# EAGLE design V3 nrf5 (EAGLE 9.6.2)
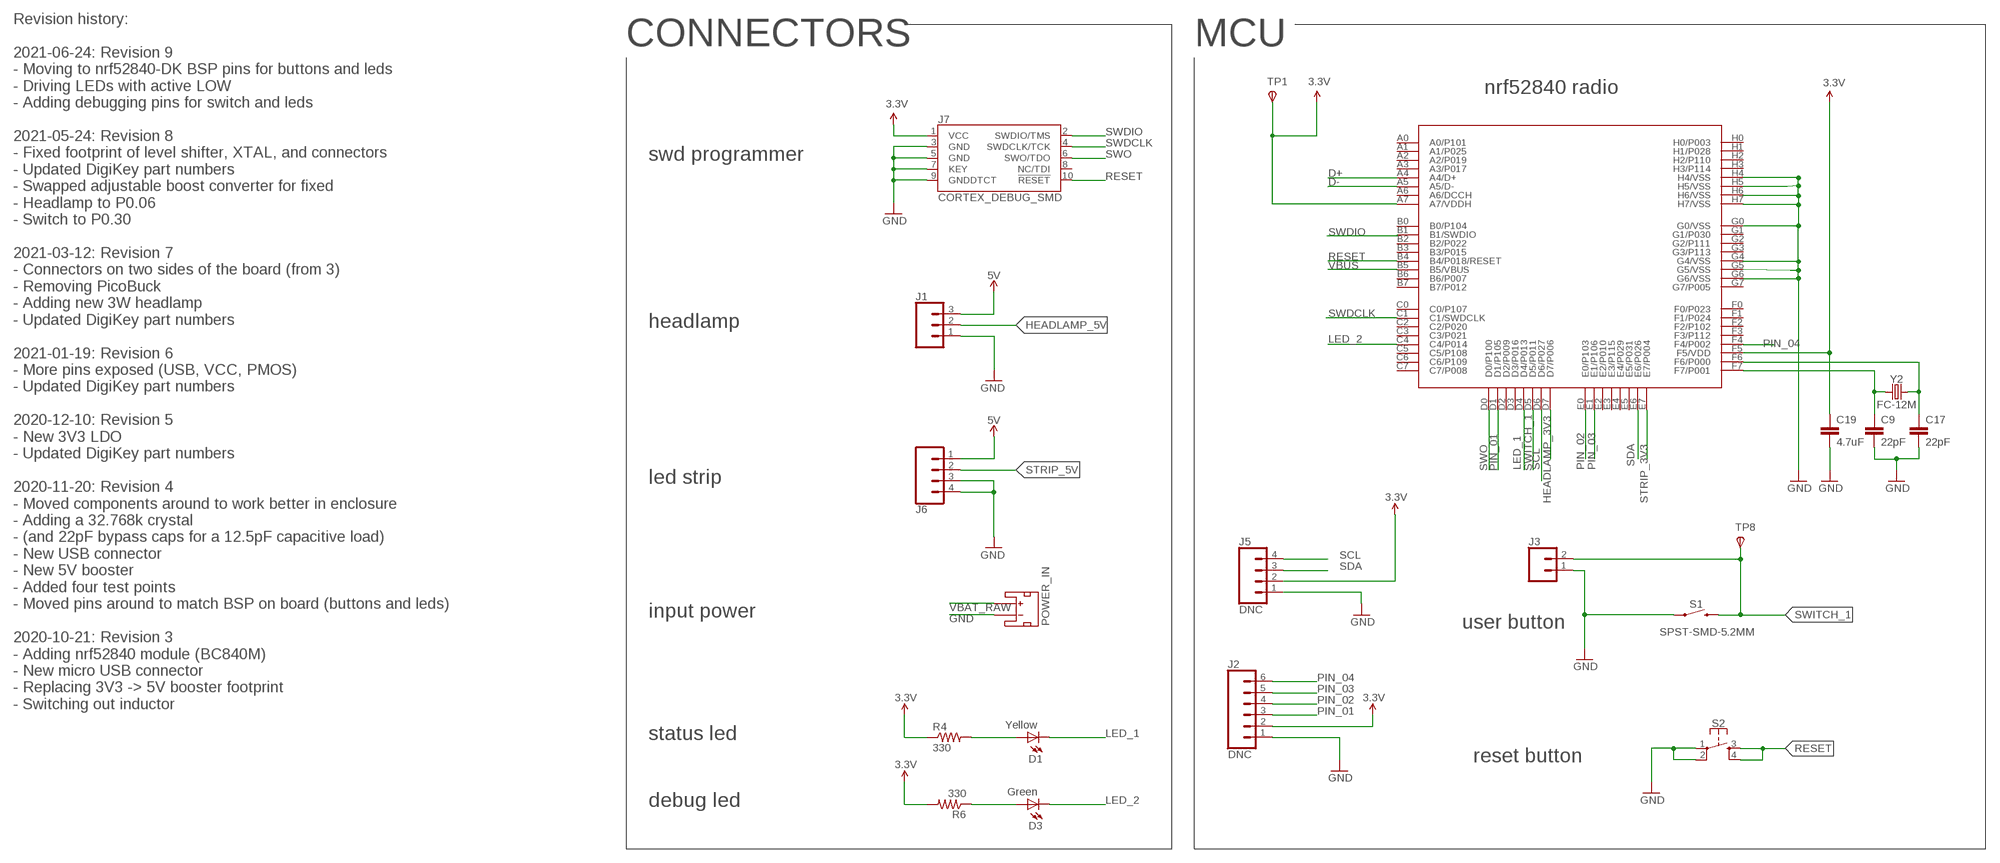
[diagram p0: schematic, sheet 1, part 1 of 2]
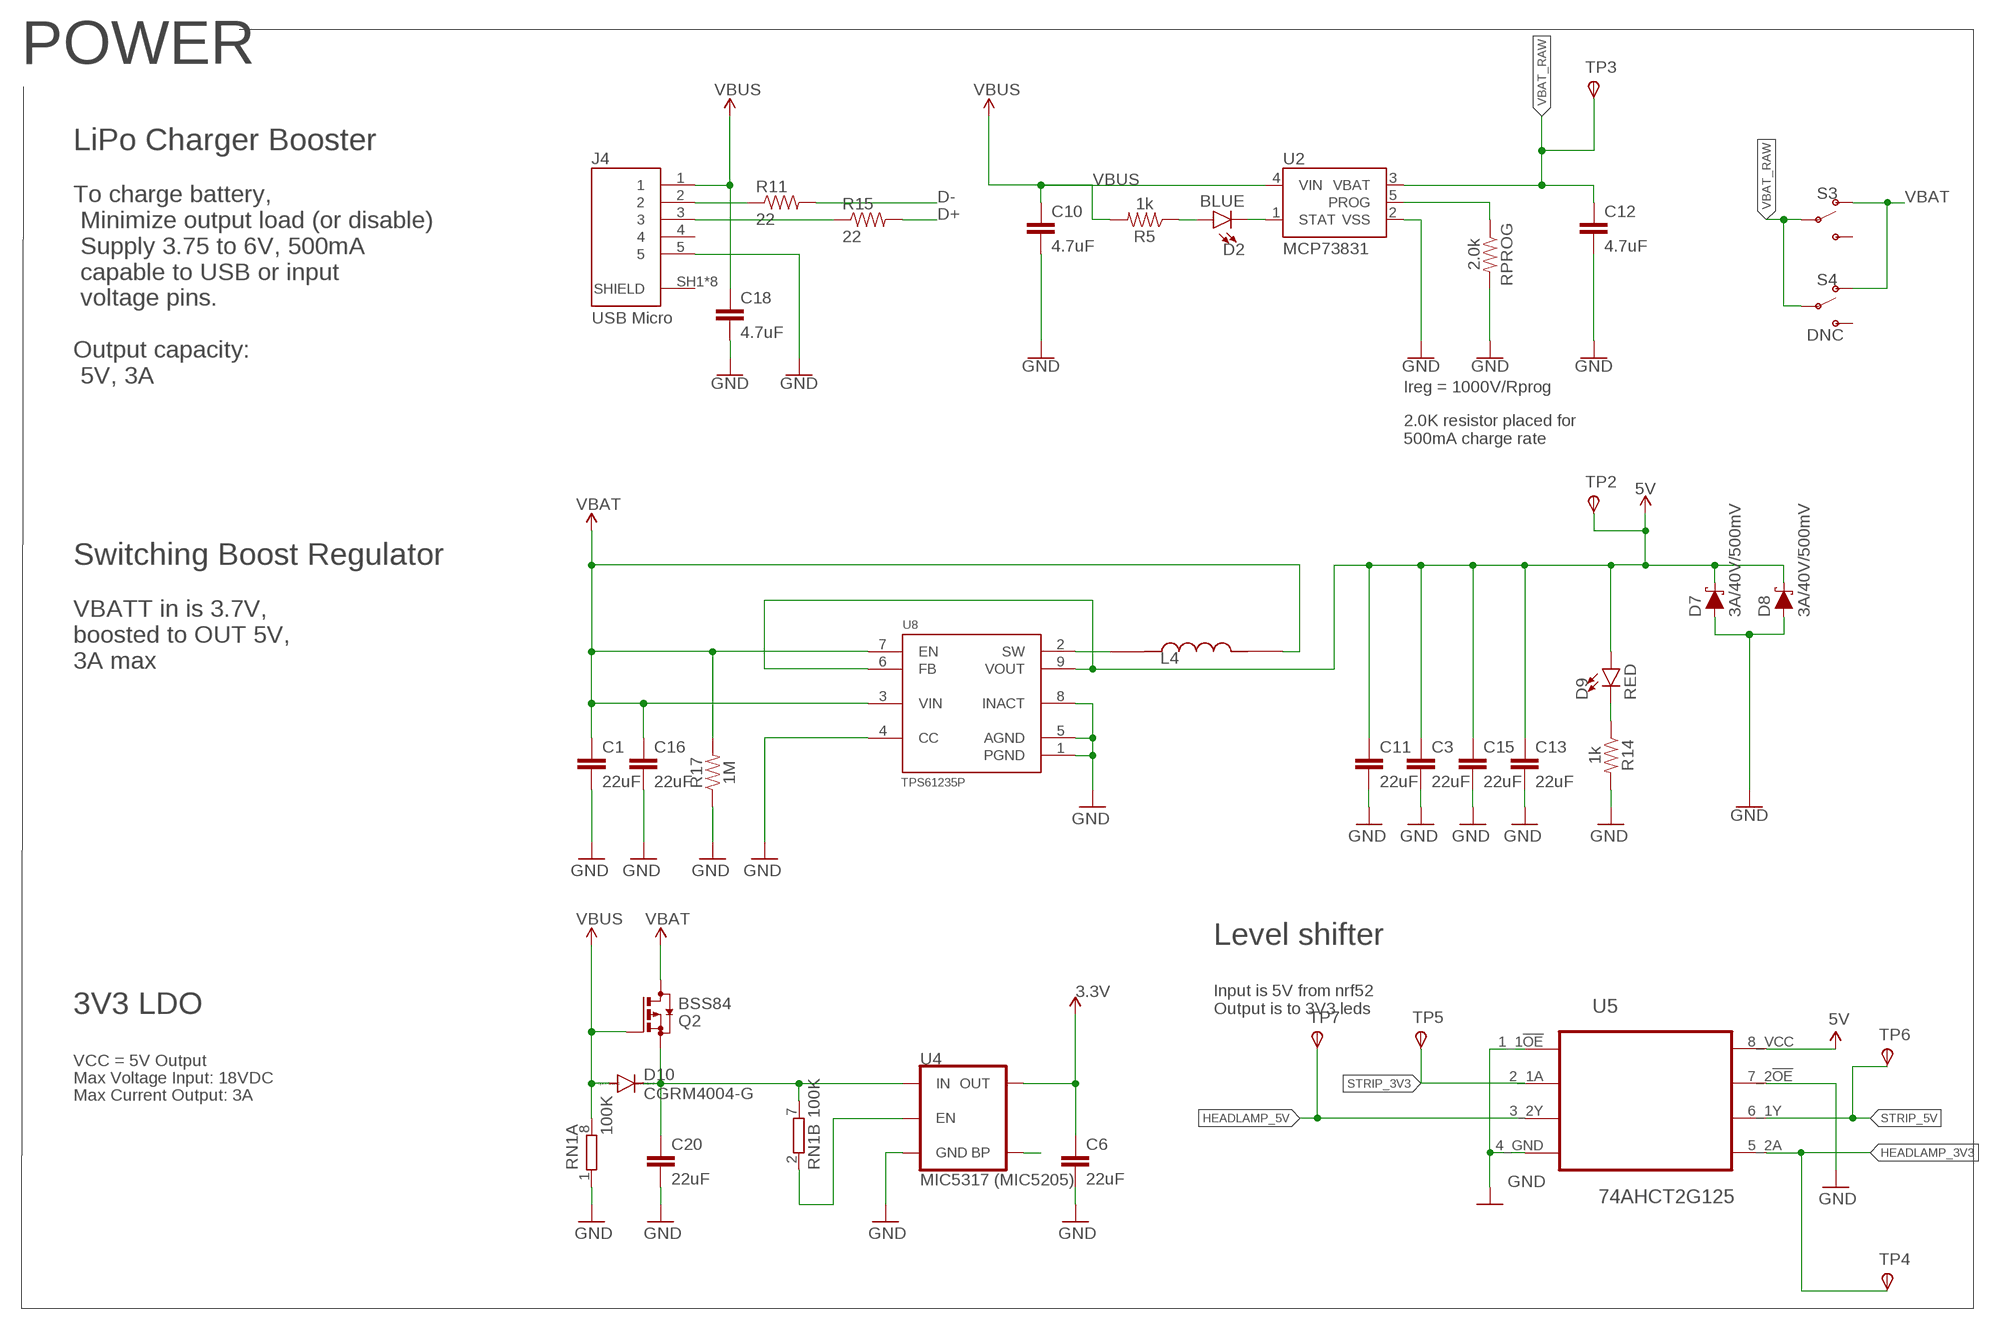
[diagram p1: schematic, sheet 1, part 2 of 2]

## Parts
C1  22uF  22UF-0805-6.3V-20%  [0805]
C3  22uF  22UF-0805-6.3V-20%  [0805]
C6  22uF  22UF-0805-6.3V-20%  [0805]
C9  22pF  22UF-0805-6.3V-20%  [0805]
C10  4.7uF  4.7UF0603  [0603]
C11  22uF  22UF-0805-6.3V-20%  [0805]
C12  4.7uF  4.7UF0603  [0603]
C13  22uF  22UF-0805-6.3V-20%  [0805]
C15  22uF  22UF-0805-6.3V-20%  [0805]
C16  22uF  22UF-0805-6.3V-20%  [0805]
C17  22pF  22UF-0805-6.3V-20%  [0805]
C18  4.7uF  4.7UF0603  [0603]
C19  4.7uF  4.7UF0603  [0603]
C20  22uF  22UF-0805-6.3V-20%  [0805]
D1  Yellow  LED0603  [LED-0603]
D2  BLUE  LED-BLUE0603  [LED-0603]
D3  Green  LED0603  [LED-0603]
D7  3A/40V/500mV  DIODE-SCHOTTKY-B340A  [SMA-DIODE]
D8  3A/40V/500mV  DIODE-SCHOTTKY-B340A  [SMA-DIODE]
D9  RED  LED-RED0603  [LED-0603]
D10  CGRM4004-G  [SOD-123_MINI-SMA]
J1  CONN_03SCREW_LOCK  [SCREWTERMINAL-3.5MM-3_LOCK.007S]
J2  DNC  CONN_06SMD-1MM  [1X06-1MM]
J3  CONN_02  [1X02]
J4  USB Micro  1050170001  [MOLEX_1050170001]
J5  DNC  CONN_04SMD2  [1X04_1MM_RA]
J6  CONN_04SCREW  [SCREWTERMINAL-3.5MM-4]
J7  CORTEX_DEBUG_SMD  [SAMTECH_FTSH-105-01]
L4  1.0 uH  FDSD0630-H-1R0M=P3  [IND_FDSD0630-H-1R0M=P3]
POWER_IN  JST_2MM_MALE  [JST-2-SMD]
Q2  BSS84  [SOT23]
R4  330  RESISTOR0603-RES  [0603-RES]
R5  1k  1KOHM-0603-1/10W-1%  [0603]
R6  330  RESISTOR0603-RES  [0603-RES]
R11  22  RESISTOR0603-RES  [0603-RES]
R14  1k  1KOHM-0603-1/10W-1%  [0603]
R15  22  RESISTOR0603-RES  [0603-RES]
R17  1M  750KOHM-0603-1/10W-1%  [0603@1]
RN1  100K  4R-NEXB38V  [EXB38V]
RPROG  2.0k  2.0KOHM-0603-1/10W-5%  [0603]
S1  SPST-SMD-5.2MM  MOMENTARY-SWITCH-SPST-SMD-5.2MM  [TACTILE_SWITCH_SMD_5.2MM]
S2  MOMENTARY-SWITCH-SPST-2-SMD-4.6X2.8MM  [TACTILE_SWITCH_SMD_4.6X2.8MM]
S3  SWITCH-SPDT-SMD-RIGHT-ANGLE  [SWITCH_SPST_SMD_A]
S4  DNC  SWITCH-SPDT-PTH-11.6X4.0MM  [SWITCH_SPDT_PTH_11.6X4.0MM]
TP1  TPSB1,27  [B1,27]
TP2  TPSB1,27  [B1,27]
TP3  TPSB1,27  [B1,27]
TP4  TPSB1,27  [B1,27]
TP5  TPSB1,27  [B1,27]
TP6  TPSB1,27  [B1,27]
TP7  TPSB1,27  [B1,27]
TP8  TPSB1,27  [B1,27]
U2  MCP73831  [SOT23-5]
U3  BC840M  [BC840M]
U4  MIC5317 (MIC5205)  V_REG_MIC52053.3V  [SOT23-5]
U5  74AHCT2G125  VSSOP-8_DEVICE  [VSSOP-8]
U8  TPS61235P  TPS61235PRWLR  [CONV_TPS61235PRWLR]
Y2  FC-12M  [FC-12M]

## Nets
3.3V: C6.1 C19.1 J2.2 J5.2 J7.1(VCC) R4.1 R6.2 TP1.TP(PP) U3.A7(A7/VDDH) U3.F5(F5/VDD) U4.5(OUT) ; supply symbol labelled VCC
5V: C3.1 C11.1 C13.1 C15.1 D7.C D8.C D9.A J1.3 J6.1 TP2.TP(PP) U5.8_VCC U8.6(FB) U8.9(VOUT)
D+: R15.2 U3.A4(A4/D+)
D-: R11.2 U3.A5(A5/D-)
GND: C1.2 C3.2 C6.2 C9.2 C10.2 C11.2 C12.2 C13.2 C15.2 C16.2 C17.2 C18.2 C19.2 C20.2 D7.A D8.A J1.1 J2.1 J3.1 J4.5 J5.1 J6.3 J6.4 J7.3(GND) J7.5(GND) J7.7(KEY) J7.9(GNDDTCT) POWER_IN.1(-) R14.2 R17.1 RN1.1 RPROG.2 S1.1 S2.1 S2.2 U2.2(VSS) U3.G0(G0/VSS) U3.G4(G4/VSS) U3.G5(G5/VSS) U3.G6(G6/VSS) U3.H4(H4/VSS) U3.H5(H5/VSS) U3.H6(H6/VSS) U3.H7(H7/VSS) U4.2(GND) U5.1_1!OE U5.4_GND U5.7_2!OE U8.1(PGND) U8.4(CC) U8.5(AGND) U8.8(INACT)
HEADLAMP_3V3: TP4.TP(PP) U3.D7(D7/P006) U5.5_2A
HEADLAMP_5V: J1.2 TP7.TP(PP) U5.3_2Y
LED_1: D1.C U3.D4(D4/P013)
LED_2: D3.C U3.C4(C4/P014)
N$1: D1.A R4.2
N$2: C9.1 U3.F7(F7/P001) Y2.1
N$3: L4.1 U8.2(SW)
N$4: C20.1 D10.C Q2.2(S) RN1.7 U4.1(IN)
N$5: RN1.2 U4.3(EN)
N$6: U4.4(BP)
N$8: D3.A R6.1
N$11: RPROG.1 U2.5(PROG)
N$12: J4.2 R11.1
N$13: D9.C R14.1
N$14: D2.C U2.1(STAT)
N$15: D2.A R5.1
N$16: J4.3 R15.1
N$17: C17.1 U3.F6(F6/P000) Y2.2
PIN_01: J2.3 U3.D1(D1/P105)
PIN_02: J2.4 U3.E0(E0/P103)
PIN_03: J2.5 U3.E1(E1/P106)
PIN_04: J2.6 U3.F4(F4/P002)
RESET: J7.10(!RESET) S2.3 S2.4 U3.B4(B4/P018/RESET)
SCL: J5.4 U3.D6(D6/P027)
SDA: J5.3 U3.E6(E6/P026)
STRIP_3V3: TP5.TP(PP) U3.E7(E7/P004) U5.2_1A
STRIP_5V: J6.2 TP6.TP(PP) U5.6_1Y
SWDCLK: J7.4(SWDCLK/TCK) U3.C1(C1/SWDCLK)
SWDIO: J7.2(SWDIO/TMS) U3.B1(B1/SWDIO)
SWITCH_1: J3.2 S1.3 TP8.TP(PP) U3.D5(D5/P011)
SWO: J7.6(SWO/TDO) U3.D0(D0/P100)
VBAT: C1.1 C16.1 L4.2 Q2.3(D) R17.2 S3.1(O) S4.1(O) U8.3(VIN) U8.7(EN)
VBAT_RAW: C12.1 POWER_IN.2(+) S3.2(P) S4.2(P) TP3.TP(PP) U2.3(VBAT)
VBUS: C10.1 C18.1 D10.A J4.1 Q2.1(G) R5.2 RN1.8 U2.4(VIN) U3.B5(B5/VBUS)
Unconnected: J4.4 J4.SH1(SHIELD) J4.SH2(SHIELD) J4.SH3(SHIELD) J4.SH4(SHIELD) J4.SH5(SHIELD) J4.SH6(SHIELD) J4.SH7(SHIELD) J4.SH8(SHIELD) J7.8(NC/TDI) POWER_IN.NC1(PAD1) POWER_IN.NC2(PAD2) RN1.3 RN1.4 RN1.5 RN1.6 S3.3(S) S4.3(S) U3.A0(A0/P101) U3.A1(A1/P025) U3.A2(A2/P019) U3.A3(A3/P017) U3.A6(A6/DCCH) U3.B0(B0/P104) U3.B2(B2/P022) U3.B3(B3/P015) U3.B6(B6/P007) U3.B7(B7/P012) U3.C0(C0/P107) U3.C2(C2/P020) U3.C3(C3/P021) U3.C5(C5/P108) U3.C6(C6/P109) U3.C7(C7/P008) U3.D2(D2/P009) U3.D3(D3/P016) U3.E2(E2/P010) U3.E3(E3/P115) U3.E4(E4/P029) U3.E5(E5/P031) U3.F0(F0/P023) U3.F1(F1/P024) U3.F2(F2/P102) U3.F3(F3/P112) U3.G1(G1/P030) U3.G2(G2/P111) U3.G3(G3/P113) U3.G7(G7/P005) U3.H0(H0/P003) U3.H1(H1/P028) U3.H2(H2/P110) U3.H3(H3/P114)

## Notes on the sheet
- Revision history:
  
  2021-06-24: Revision 9
  - Moving to nrf52840-DK BSP pins for buttons and leds
  - Driving LEDs with active LOW
  - Adding debugging pins for switch and leds
  
  2021-05-24: Revision 8
  - Fixed footprint of level shifter, XTAL, and connectors
  - Updated DigiKey part numbers
  - Swapped adjustable boost converter for fixed
  - Headlamp to P0.06
  - Switch to P0.30
  
  2021-03-12: Revision 7
  - Connectors on two sides of the board (from 3)
  - Removing PicoBuck
  - Adding new 3W headlamp
  - Updated DigiKey part numbers
  
  2021-01-19: Revision 6
  - More pins exposed (USB, VCC, PMOS)
  - Updated DigiKey part numbers
  
  2020-12-10: Revision 5
  - New 3V3 LDO
  - Updated DigiKey part numbers
  
  2020-11-20: Revision 4
  - Moved components around to work better in enclosure
  - Adding a 32.768k crystal 
  - (and 22pF bypass caps for a 12.5pF capacitive load) 
  - New USB connector
  - New 5V booster
  - Added four test points
  - Moved pins around to match BSP on board (buttons and leds)
  
  2020-10-21: Revision 3
  - Adding nrf52840 module (BC840M)
  - New micro USB connector
  - Replacing 3V3 -> 5V booster footprint
  - Switching out inductor
- CONNECTORS | MCU | POWER
- nrf52840 radio
- LiPo Charger Booster
- To charge battery,
   Minimize output load (or disable)
   Supply 3.75 to 6V, 500mA
   capable to USB or input
   voltage pins.
- swd programmer
- Output capacity:
   5V, 3A
- Ireg = 1000V/Rprog
- 2.0K resistor placed for
  500mA charge rate
- headlamp
- Switching Boost Regulator
- VBATT in is 3.7V, 
  boosted to OUT 5V, 
  3A max
- led strip
- input power
- user button | Level shifter
- 3V3 LDO
- Input is 5V from nrf52
  Output is to 3V3 leds
- VCC = 5V Output
- Max Voltage Input: 18VDC
- Max Current Output: 3A
- status led
- reset button
- debug led

## Library data of the parts
C1 C3 C6 C11 C13 C15 C16 C20 = SparkFun-Capacitors:22UF: 22µF ceramic capacitors A capacitor is a passive two-terminal electrical component used to store electrical energy temporarily in an electric field.; DIGIKEY: 490-10511-1-ND; PROD_ID: CAP-08402
C9 C17 = SparkFun-Capacitors:22UF: 22µF ceramic capacitors A capacitor is a passive two-terminal electrical component used to store electrical energy temporarily in an electric field.; DIGIKEY: 399-C0805C220K5HAC7800CT-ND; PROD_ID: CAP-08402; VALUE: 22uF
C10 C12 C18 C19 = SparkFun-Capacitors:4.7UF: 4.7µF ceramic capacitors A capacitor is a passive two-terminal electrical component used to store electrical energy temporarily in an electric field.; DIGIKEY: 399-3482-1-ND; PROD_ID: CAP-08280
D1 = SparkFun:LED: LEDs Standard schematic elements and footprints for 5mm, 3mm, 1206, and 0603 sized LEDs. 5mm - Spark Fun Electronics SKU : COM-00529 (and others); DIGIKEY: 160-1184-1-ND
D2 = SparkFun-LED:LED-BLUE: Blue SMD LED Used in manufacturing of various products at SparkFun Packages: 0603 - SMD 0603 package [Product Link] <http://www.digikey.com/product-detail/en/SMLE12BC7TT86/511-1589-2-ND/1641808> 1206 - SMD1206 package [Product Link] <http://www.digikey.com/product-detail/en/lite-on-inc/LTST-C150TBKT/160-1643-1-ND/573584> SparkFun Products: ESP8266 Thing-Dev Board <https://www.sparkfun.com/products/13711> RedBoard <https://www.sparkfun.com/products/12757>; DIGIKEY: 160-1647-1-ND; PROD_ID: DIO-08575
D3 = SparkFun:LED: LEDs Standard schematic elements and footprints for 5mm, 3mm, 1206, and 0603 sized LEDs. 5mm - Spark Fun Electronics SKU : COM-00529 (and others); DIGIKEY: 754-1116-2-ND
D7 D8 = SparkFun-DiscreteSemi:DIODE-SCHOTTKY: Schottky diode A Schottky diode is a semiconductor diode which has a low forward voltage drop and a very fast switching action.; DIGIKEY: MBRA340T3GOSTR-ND; PROD_ID: DIO-09886
D9 = SparkFun-LED:LED-RED: Red SMD LED Used in manufacturing of most products at SparkFun Packages: 0603 - SMD 0603 package [Product Link] <http://docs.avagotech.com/docs/AV02-0551EN> 0603 SMART - SMD 0603 SMART package ( more efficient and expensive)[Product Link] <http://www.osram-os.com/Graphics/XPic2/00077099_0.pdf> 1206 - SMD1206 package [Product Link] <https://www.sparkfun.com/datasheets/DevTools/LilyPad/Q150OVS4.pdff> SparkFun Products: Pro Mini 328 -5V <https://www.sparkfun.com/products/821> RedBoard <https://www.sparkfun.com/products/12757> IOIO-OTG <https://www.sparkfun.com/products/13613>; DIGIKEY: 160-1436-1-ND; PROD_ID: DIO-00819
D10 = diode:CGRM400*-G: Molded plasitc,JEDEC SOD-123/Mini SMA Source: Comchip CGRM4001-G.pdf; DIGIKEY: SM5817PL-TPMSCT-ND‎
J1 = SparkFun-Connectors:CONN_03: Multi connection point. Often used as Generic Header-pin footprint for 0.1 inch spaced/style header connections On any of the 0.1 inch spaced packages, you can populate with these: Break Away Headers - Straight <https://www.sparkfun.com/products/116> (PRT-00116) Break Away Male Headers - Right Angle <https://www.sparkfun.com/products/553> (PRT-00553) Female Headers <https://www.sparkfun.com/products/115> (PRT-00115) Break Away Headers - Machine Pin <https://www.sparkfun.com/products/117> (PRT-00117) Break Away Female Headers - Swiss Machine Pin <https://www.sparkfun.com/products/743> (PRT-00743) Stackable Header - 3 Pin (Female, 0.1") <https://www.sparkfun.com/products/13875> (PRT-13875) For SCREWTERMINALS and SPRING TERMINALS visit here: Screw Terimnals on SparkFun.com <https://www.sparkfun.com/search/results?term=Screw+Terminals> (5mm/3.5mm/2.54mm spacing) This device is also useful as a general connection point to wire up your design to another part of your project. Our various solder wires solder well into these plated through hole pads. Hook-Up Wire - Assortment (Stranded, 22 AWG) <https://www.sparkfun.com/products/11375> (PRT-11375) Hook-Up Wire - Assortment (Solid Core, 22 AWG) <https://www.sparkfun.com/products/11367> (PRT-11367) View the entire wire category on our website here <https://www.sparkfun.com/categories/141> Special notes: Molex polarized connector foot print use with SKU : PRT-08232 with associated crimp pins and housings.; DIGIKEY: A98037-ND; PROD_ID: CONN-08288; SF_ID: PRT-08235
J2 = SparkFun-Connectors:CONN_06: Multi connection point. Often used as Generic Header-pin footprint for 0.1 inch spaced/style header connections On any of the 0.1 inch spaced packages, you can populate with these: Break Away Headers - Straight <https://www.sparkfun.com/products/116> (PRT-00116) Break Away Male Headers - Right Angle <https://www.sparkfun.com/products/553> (PRT-00553) Female Headers <https://www.sparkfun.com/products/115> (PRT-00115) Break Away Headers - Machine Pin <https://www.sparkfun.com/products/117> (PRT-00117) Break Away Female Headers - Swiss Machine Pin <https://www.sparkfun.com/products/743> (PRT-00743) Arduino Stackable Header - 6 Pin <https://www.sparkfun.com/products/9280> (PRT-09280) For SCREWTERMINALS and SPRING TERMINALS visit here: Screw Terimnals on SparkFun.com <https://www.sparkfun.com/search/results?term=Screw+Terminals> (5mm/3.5mm/2.54mm spacing) This device is also useful as a general connection point to wire up your design to another part of your project. Our various solder wires solder well into these plated through hole pads. Hook-Up Wire - Assortment (Stranded, 22 AWG) <https://www.sparkfun.com/products/11375> (PRT-11375) Hook-Up Wire - Assortment (Solid Core, 22 AWG) <https://www.sparkfun.com/products/11367> (PRT-11367) View the entire wire category on our website here <https://www.sparkfun.com/categories/141>; PROD_ID: CONN-08249; SF_ID: GPS-00579
J3 = SparkFun-Connectors:CONN_02: Multi connection point. Often used as Generic Header-pin footprint for 0.1 inch spaced/style header connections On any of the 0.1 inch spaced packages, you can populate with these: Break Away Headers - Straight <https://www.sparkfun.com/products/116> (PRT-00116) Break Away Male Headers - Right Angle <https://www.sparkfun.com/products/553> (PRT-00553) Female Headers <https://www.sparkfun.com/products/115> (PRT-00115) Break Away Headers - Machine Pin <https://www.sparkfun.com/products/117> (PRT-00117) Break Away Female Headers - Swiss Machine Pin <https://www.sparkfun.com/products/743> (PRT-00743) For SCREWTERMINALS and SPRING TERMINALS visit here: Screw Terimnals on SparkFun.com <https://www.sparkfun.com/search/results?term=Screw+Terminals> (5mm/3.5mm/2.54mm spacing) This device is also useful as a general connection point to wire up your design to another part of your project. Our various solder wires solder well into these plated through hole pads. Hook-Up Wire - Assortment (Stranded, 22 AWG) <https://www.sparkfun.com/products/11375> (PRT-11375) Hook-Up Wire - Assortment (Solid Core, 22 AWG) <https://www.sparkfun.com/products/11367> (PRT-11367) View the entire wire category on our website here <https://www.sparkfun.com/categories/141> Special notes: Molex polarized connector foot print use with: PRT-08233 with associated crimp pins and housings. 2.54_SCREWTERM for use with PRT-10571. 3.5mm Screw Terminal footprints for PRT-08084 5mm Screw Terminal footprints for use with PRT-08432
J4 = 1050170001:1050170001: Conn.; Data; USB; Recept.; Micro; B Type; Bottom Mount, SMT, with Solder Tabs, Lead-Free Check prices <https://pricing.snapeda.com/parts/1050170001/Molex/view-part?ref=eda>; AVAILABILITY: Good; DESCRIPTION: USB - micro B USB 2.0 Receptacle Connector 5 Position Surface Mount, Right Angle; Through Hole; DIGIKEY: WM1399CT-ND; MF: Molex; MP: 1050170001; PACKAGE: None; PRICE: None; PURCHASE-URL: https://pricing.snapeda.com/search/part/1050170001/?ref=eda
J5 = SparkFun-Connectors:CONN_04: Multi connection point. Often used as Generic Header-pin footprint for 0.1 inch spaced/style header connections On any of the 0.1 inch spaced packages, you can populate with these: Break Away Headers - Straight <https://www.sparkfun.com/products/116> (PRT-00116) Break Away Male Headers - Right Angle <https://www.sparkfun.com/products/553> (PRT-00553) Female Headers <https://www.sparkfun.com/products/115> (PRT-00115) Break Away Headers - Machine Pin <https://www.sparkfun.com/products/117> (PRT-00117) Break Away Female Headers - Swiss Machine Pin <https://www.sparkfun.com/products/743> (PRT-00743) For SCREWTERMINALS and SPRING TERMINALS visit here: Screw Terimnals on SparkFun.com <https://www.sparkfun.com/search/results?term=Screw+Terminals> (5mm/3.5mm/2.54mm spacing) This device is also useful as a general connection point to wire up your design to another part of your project. Our various solder wires solder well into these plated through hole pads. Hook-Up Wire - Assortment (Stranded, 22 AWG) <https://www.sparkfun.com/products/11375> (PRT-11375) Hook-Up Wire - Assortment (Solid Core, 22 AWG) <https://www.sparkfun.com/products/11367> (PRT-11367) View the entire wire category on our website here <https://www.sparkfun.com/categories/141> Special notes: Molex polarized connector foot print use with SKU : PRT-08231 with associated crimp pins and housings. 1MM SMD Version SKU: PRT-10208; PROD_ID: CONN-10310; SF_ID: PRT-10208
J6 = SparkFun-Connectors:CONN_04: Multi connection point. Often used as Generic Header-pin footprint for 0.1 inch spaced/style header connections On any of the 0.1 inch spaced packages, you can populate with these: Break Away Headers - Straight <https://www.sparkfun.com/products/116> (PRT-00116) Break Away Male Headers - Right Angle <https://www.sparkfun.com/products/553> (PRT-00553) Female Headers <https://www.sparkfun.com/products/115> (PRT-00115) Break Away Headers - Machine Pin <https://www.sparkfun.com/products/117> (PRT-00117) Break Away Female Headers - Swiss Machine Pin <https://www.sparkfun.com/products/743> (PRT-00743) For SCREWTERMINALS and SPRING TERMINALS visit here: Screw Terimnals on SparkFun.com <https://www.sparkfun.com/search/results?term=Screw+Terminals> (5mm/3.5mm/2.54mm spacing) This device is also useful as a general connection point to wire up your design to another part of your project. Our various solder wires solder well into these plated through hole pads. Hook-Up Wire - Assortment (Stranded, 22 AWG) <https://www.sparkfun.com/products/11375> (PRT-11375) Hook-Up Wire - Assortment (Solid Core, 22 AWG) <https://www.sparkfun.com/products/11367> (PRT-11367) View the entire wire category on our website here <https://www.sparkfun.com/categories/141> Special notes: Molex polarized connector foot print use with SKU : PRT-08231 with associated crimp pins and housings. 1MM SMD Version SKU: PRT-10208; DIGIKEY: 277-1860-ND; PROD_ID: 2xCONN-08399; SF_ID: 2xPRT-08084
J7 = SparkFun-Connectors:CORTEX_DEBUG: Cortex Debug Connector - 10 pin Supports JTAG debug, Serial Wire debug, and Serial Wire Viewer. PTH and SMD connector options available. General Connector Information <http://infocenter.arm.com/help/topic/com.arm.doc.faqs/attached/13634/cortex_debug_connectors.pdf> Products: PTH Connector <http://www.digikey.com/product-detail/en/cnc-tech/3220-10-0100-00/1175-1627-ND/3883661> -via Digi-Key SparkFun PSoc <https://www.sparkfun.com/products/13229> SparkFun T <https://www.sparkfun.com/products/13810>; DIGIKEY: SAM1161-05-ND
L4 = FDSD0630-H-1R0M_P3:FDSD0630-H-1R0M=P3: 2.2µH Shielded Wirewound Inductor 7.1A 17mOhm Max Nonstandard; DESCRIPTION: Inductor with Inductance: 1uH Tol. +/-20%, Package: 2726 (7066); DIGI-KEY_PART_NUMBER: 490-10878-1-ND; DIGIKEY: 490-10878-1-ND; MF: Murata; MP: FDSD0630-H-1R0M=P3; PACKAGE: NONSTANDARD; PURCHASE-URL: https://pricing.snapeda.com/search/part/FDSD0630-H-1R0M=P3/?ref=eda
POWER_IN = SparkFun-Connectors:JST_2MM_MALE: JST 2MM MALE RA CONNECTOR Two pin, compact surface mount connector. Commonly used as a battery input connection point. We really like the solid locking feeling and high current rating on these small connectors. We use these all the time as battery connectors. Mates to single-cell LiPo batteries. Here is the connector we sell at SparkFun: JST Right Angle Connector - White <https://www.sparkfun.com/products/8612> (PRT-08612) Datasheet <http://www.sparkfun.com/datasheets/Prototyping/Connectors/JST-Horizontal.pdf> It was used on these SparkFun products: SparkFun MOSFET Power Controller <https://www.sparkfun.com/products/11214> (PRT-11214) SparkFun Battery Babysitter - LiPo Battery Manager <https://www.sparkfun.com/products/13777> (PRT-13777) And many, many others that required a lipo battery connection.; DIGIKEY: A100080CT-ND; PROD_ID: CONN-11443; SF_ID: PRT-08612
Q2 = transistor-small-signal:BSS84: P-CHANNEL MOS FET; DIGIKEY: DMP2120U-7DITR-ND
R4 R6 = SparkFun:RESISTOR: Resistor Basic schematic elements and footprints for 0603, 1206, and PTH resistors.; DIGIKEY: 311-330HRTR-ND
R5 R14 = SparkFun-Resistors:1KOHM: 1kΩ resistor A resistor is a passive two-terminal electrical component that implements electrical resistance as a circuit element. Resistors act to reduce current flow, and, at the same time, act to lower voltage levels within circuits. - Wikipedia; DIGIKEY: RMCF0603FG1K00; PROD_ID: RES-07856
R11 R15 = SparkFun:RESISTOR: Resistor Basic schematic elements and footprints for 0603, 1206, and PTH resistors.; DIGIKEY: A103067TR-ND
R17 = SparkFun-Resistors:750KOHM: 750Ω resistor A resistor is a passive two-terminal electrical component that implements electrical resistance as a circuit element. Resistors act to reduce current flow, and, at the same time, act to lower voltage levels within circuits. - Wikipedia; DIGIKEY: RMCF0603FT1M00; PROD_ID: RES-13768; VALUE: 750K
RN1 = resistor-dil:4R-N: Array Chip Resistor Source: RS Component / Phycomp; DIGIKEY: YC164J-100KTR-ND; OC_FARNELL: unknown; OC_NEWARK: unknown
RPROG = SparkFun-Resistors:2.0KOHM: 2kΩ resistor A resistor is a passive two-terminal electrical component that implements electrical resistance as a circuit element. Resistors act to reduce current flow, and, at the same time, act to lower voltage levels within circuits. - Wikipedia; DIGIKEY: ‎311-2.00KHRCT-ND‎; PROD_ID: RES-08296
S1 = SparkFun-Switches:MOMENTARY-SWITCH-SPST: Momentary Switch (Pushbutton) - SPST Normally-open (NO) SPST momentary switches (buttons, pushbuttons). Variants PTH-12MM - 12mm square, through-hole Momentary Pushbutton Switch - 12mm Square <https://www.sparkfun.com/products/9190> (COM-09190) PTH-6.0MM, PTH-6.0MM-KIT - 6.0mm square, through-hole Mini Pushbutton Switch <https://www.sparkfun.com/products/97> (COM-00097) KIT package intended for soldering kit's - only one side of pads' copper is exposed. PTH-RIGHT-ANGLE-KIT - Right-angle, through-hole Right Angle Tactile Button <https://www.sparkfun.com/products/10791> - Used on SparkFun BigTime Watch Kit <https://www.sparkfun.com/products/11734> SMD-12MM - 12mm square, surface-mount Tactile Button - SMD (12mm) <https://www.sparkfun.com/products/12993> (COM-12993) Used on SparkFun PicoBoard <https://www.sparkfun.com/products/11888> SMD-4.5MM - 4.5mm Square Trackball Switch Used on SparkFun Blackberry Trackballer Breakout <https://www.sparkfun.com/products/13169> SMD-4.6MMX2.8MM - 4.60mm x 2.80mm, surface mount Used on SparkFun SAMD21 Mini Breakout <https://www.sparkfun.com/products/13664> SMD-5.2MM, SMD-5.2-REDUNDANT - 5.2mm square, surface-mount Mini Pushbutton Switch - SMD <https://www.sparkfun.com/products/8720> (COM-08720) Used on Arduino Pro Mini <https://www.sparkfun.com/products/11114> REDUNDANT package connects both switch circuits together SMD-6.0X3.5MM - 6.0 x 3.5mm, surface mount Momentary Reset Switch SMD <https://www.sparkfun.com/products/8229> (COM-08229) SMD-6.2MM-TALL - 6.2mm square, surface mount Tactile Button - SMD (6mm) <https://www.sparkfun.com/products/12992> Used on SparkFun Digital Sandbox <https://www.sparkfun.com/products/12651> SMD-RIGHT-ANGLE - Right-angle, surface mount Used on SparkFun Block for Intel® Edison - Arduino <https://www.sparkfun.com/products/13036>; DIGIKEY: CKN12222-1-ND; PROD_ID: SWCH-08247; SF_SKU: COM-08720
S2 = SparkFun-Switches:MOMENTARY-SWITCH-SPST-2: Momentary Switch (Pushbutton) - SPST - Two Circuits Normally-open (NO) SPST momentary switches (buttons, pushbuttons). Schematic symbol includes two switch circuits. Variants SMD-4.6MMX2.8MM - 4.60mm x 2.80mm Tactile Momentary Button Switch - Used on SparkFun SAMD21 Mini Breakout <https://www.sparkfun.com/products/13664> SMD-5.2MM - Mini Pushbutton Switch - SMD <https://www.sparkfun.com/products/8720> - Used on Arduino Pro Mini <https://www.sparkfun.com/products/11114>; DIGIKEY: 401-1426-1-ND; PROD_ID: SWCH-13065
S3 = SparkFun-Switches:SWITCH-SPDT: Single Pole, Double Throw (SPDT) Switch Single-pole, double-throw (SPDT) switch. Variant Overview SMD-AYZ0202 Surface Mount DPDT Switch <https://www.sparkfun.com/products/597> (COM-00597) Used on e.g. LilyPad Arduino USB - ATmega32U4 Board <https://www.sparkfun.com/products/12049> PTH-11.6X4.0MM SPDT Mini Power Switch <https://www.sparkfun.com/products/102> (COM-00102) Used on e.g. SparkFun Simon Says - Through-Hole Soldering Kit <https://www.sparkfun.com/products/10547> (KIT-10547) PTH-11.6X4.0MM-KIT KIT version of SPDT Mini Power Switch - Simplifies soldering by removing tStop of switch pins - only one side can be soldered. PTH-11.6X4.0MM-LOCK LOCK version of SPDT Mini Power Switch - Offset pins hold switch in place for easier soldering. SMD-RIGHT-ANGLE Surface Mount Right Angle Switch <https://www.sparkfun.com/products/10860> (COM-10860) Used on e.g. SparkFun ESP8266 Thing <https://www.sparkfun.com/products/13231>; DIGIKEY: 563-1102-1-ND; PROD_ID: SWCH-10651; SF_SKU: COM-10860
S4 = SparkFun-Switches:SWITCH-SPDT: Single Pole, Double Throw (SPDT) Switch Single-pole, double-throw (SPDT) switch. Variant Overview SMD-AYZ0202 Surface Mount DPDT Switch <https://www.sparkfun.com/products/597> (COM-00597) Used on e.g. LilyPad Arduino USB - ATmega32U4 Board <https://www.sparkfun.com/products/12049> PTH-11.6X4.0MM SPDT Mini Power Switch <https://www.sparkfun.com/products/102> (COM-00102) Used on e.g. SparkFun Simon Says - Through-Hole Soldering Kit <https://www.sparkfun.com/products/10547> (KIT-10547) PTH-11.6X4.0MM-KIT KIT version of SPDT Mini Power Switch - Simplifies soldering by removing tStop of switch pins - only one side can be soldered. PTH-11.6X4.0MM-LOCK LOCK version of SPDT Mini Power Switch - Offset pins hold switch in place for easier soldering. SMD-RIGHT-ANGLE Surface Mount Right Angle Switch <https://www.sparkfun.com/products/10860> (COM-10860) Used on e.g. SparkFun ESP8266 Thing <https://www.sparkfun.com/products/13231>; PROD_ID: SWCH-08261; SF_SKU: COM-00102
TP1-TP8 = testpad:TPS: TEST PIN
U2 = SparkFun-IC-Power:MCP73831: MCP73831T Li-Ion, Li-Pol Controller Miniature single cell, fully integrated Li-Ion, Li-polymer charge management controller Datasheet <http://ww1.microchip.com/downloads/en/DeviceDoc/20001984g.pdf> SparkFun Products: SparkFun ESP32 Thing <https://www.sparkfun.com/products/13907> SparkFun 9DoF Razor IMU M0 <https://www.sparkfun.com/products/14001>; DIGIKEY: MCP73832T-2DFI/OTTR-ND; PROD_ID: IC-09995
U3 = BC840M-v1:BC840M; DIGIKEY: 1914-BC840MCT-ND
U4 = SparkFun-IC-Power:V_REG_MIC5205: V_REG MIC5205 Standard 3.3V, 5V, and Adjustable 150mA LDO voltage regulator in SOT-23 layout. Micrel part MIC5205. BP (by-pass) pin is used to lower output noise with 470pF cap, may be left open. On the adjustable version BP is used to set output.; DIGIKEY: MIC5317-3.3YM5-TR-ND; PROD_ID: VREG-00822; VALUE: 3.3V/150mA
U5 = VSSOP8:VSSOP-8_DEVICE: Dual bidirectional I2C-bus and SMBus voltage-level translator; DIGIKEY: 1727-6544-1-ND‎; MPN: PCA9306DC,125; OC_FARNELL: -; OC_NEWARK: 70R6429; PACKAGE: VSSOP-8; SUPPLIER: NXP
U8 = TPS61235PRWLR:TPS61235PRWLR: TPS6123x 8-A Valley Current Synchronous Boost Converters with Constant Current Output Feature 9-VQFN-HR -40 to 85; DESCRIPTION: 8-A Valley Current Synchronous Boost Converters with Constant Current Output Feature 9-VQFN-HR -40 to 85; DIGI-KEY_PART_NUMBER: 296-47376-1-ND; DIGIKEY: 296-47376-2-ND; MF: Texas Instruments; MP: TPS61235PRWLR; PACKAGE: VQFN-HR-9 Texas Instruments; PURCHASE-URL: https://pricing.snapeda.com/search/part/TPS61235PRWLR/?ref=eda
Y2 = crystal:FC-12M: kHz RANGE CRYSTAL UNIT LOW PROFILE SMD Source: Epson Toyocom FC-12M.pdf; DIGIKEY: 2195-CM8V-T1A-32.768KHZ-12.5PF-20PPM-TA-QATR-ND

## Net classes
0 default: width 0.127 mm, drill 0.305 mm, clearance 0.152 mm
1 power: width 0.508 mm

## Board
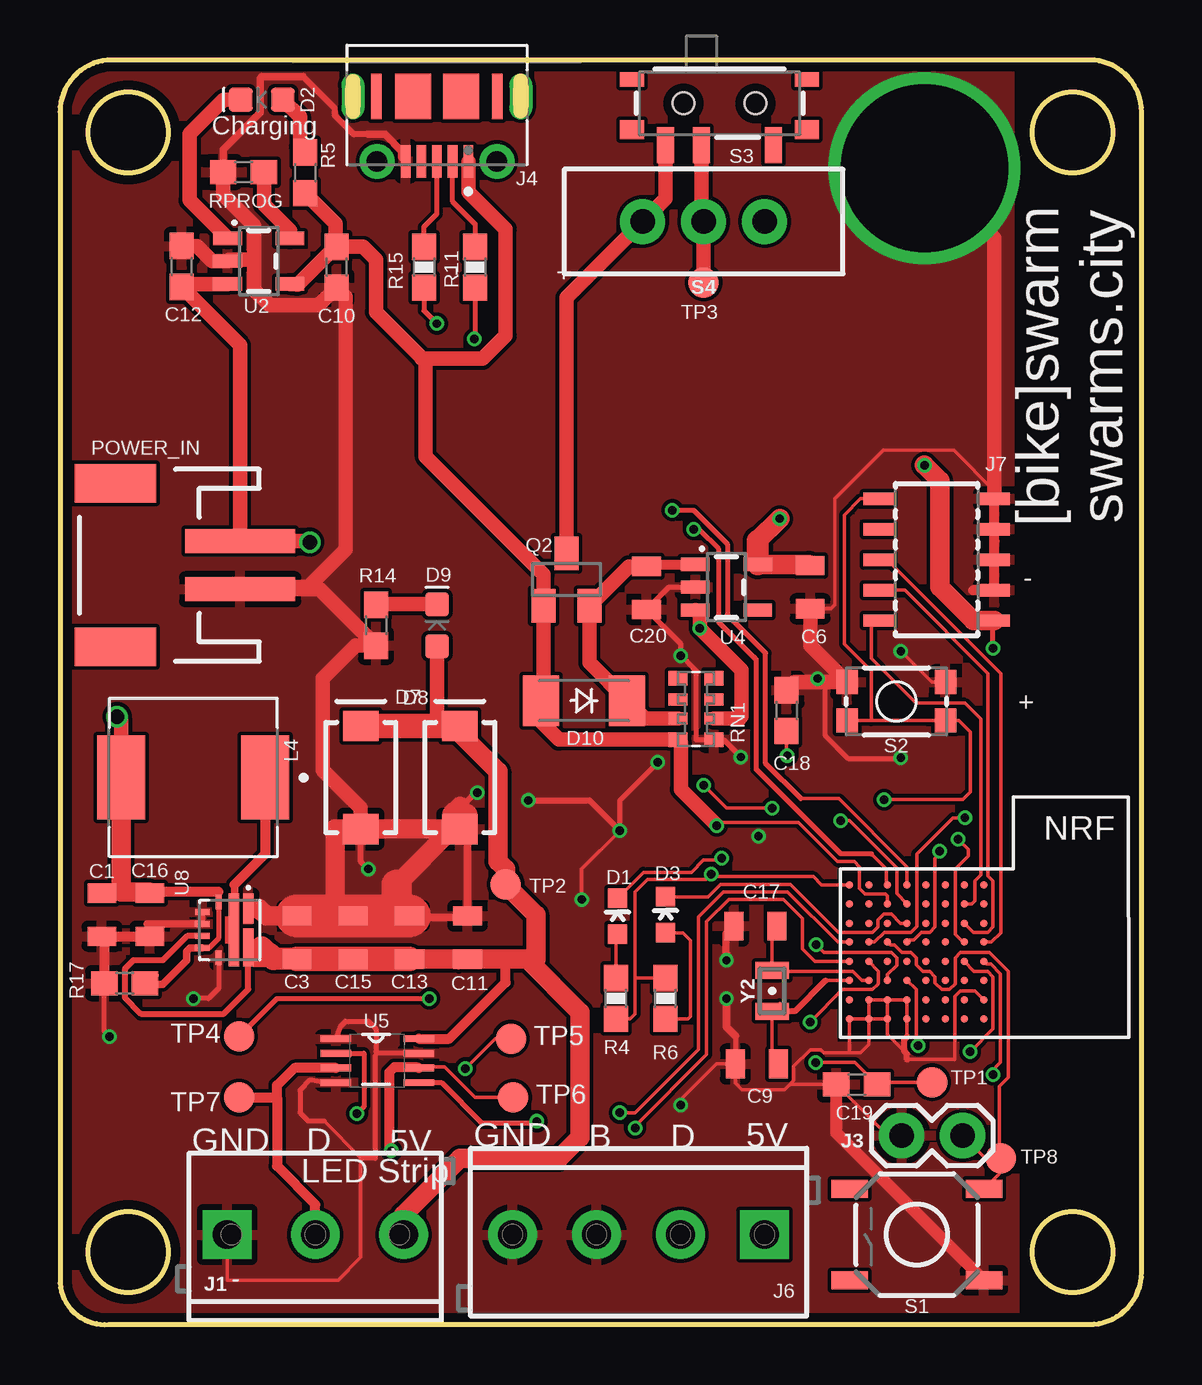
[diagram p2: board, top side]
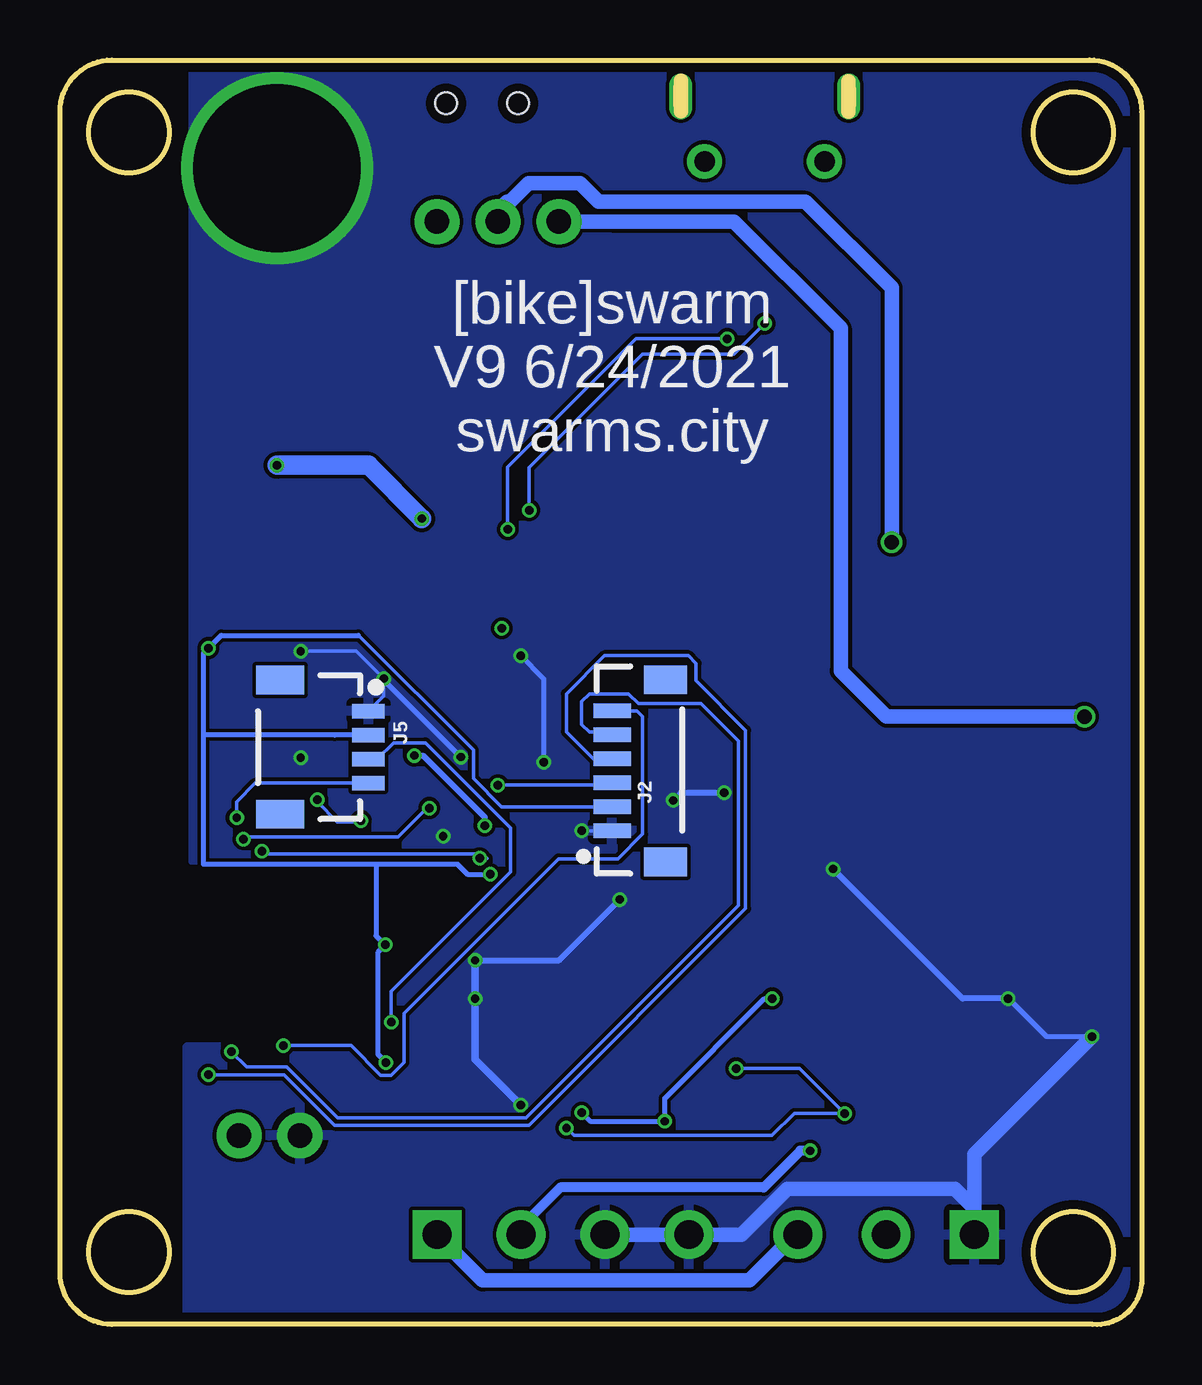
[diagram p3: board, bottom side, seen from below]

Size 45.08 x 52.71 mm. Coordinates in mm from the lower left corner, seen from the top.
Outline: 0,50.54 0,1.73 arc90 2.04,0.01 42.92,0.01 43.11,0.02 arc85 45.08,2.17 45.08,50.54 45.08,50.73 arc85 42.92,52.71 2.17,52.71 1.98,52.7 arc85 0,50.54
Outline: circle at 42.21,49.7 radius 1.68
Outline: circle at 2.84,3.02 radius 1.68
Outline: circle at 2.84,49.7 radius 1.68
Outline: circle at 42.21,3.02 radius 1.68
Copper layers (1*16): Top 0.035559375mm / dielectric 1.6mm / Bottom 0.035559375mm
Design rules "oshpark-2layer-tented": minimum track width 6mil, minimum drill 10mil, track to track 6mil, track to pad 6mil, pad to pad 6mil, via to via 6mil, smd to smd 6mil, copper to edge 15mil, drill to drill 6mil, minimum pad ring 5mil, minimum via ring 5mil, stop-mask expansion 2.5mil, vias tented up to drill 20mil, thermal gap 10mil

### Footprints (pad centres in the part's own frame; a part is rotated, then mirrored left to right if it is on the bottom)
0805 = smd 0.8 x 1.2: 1 -0.9,0; 2 0.9,0
0603 = smd 1.1 x 1: 1 -0.85,0; 2 0.85,0
LED-0603 = smd 0.8 x 0.8: A 0,-0.75; C 0,0.75
LED-0603' = smd 1 x 1: A -0.877,0; C 0.877,0
SMA-DIODE = smd 1.27 x 1.47: A -2.15,0; C 2.15,0
SOD-123_MINI-SMA = smd 1.5 x 2.1: A 1.8,0; C -1.8,0
SCREWTERMINAL-3.5MM-3_LOCK.007S = drill 1.2 pad 2.032 square: 1 -0.178,0 | drill 1.2 pad 2.032: 2 3.5,0; 3 7.178,0
1X06-1MM = smd 0.6 x 1.55: 1 -2.54,1.27; 2 -1.54,1.27; 3 -0.54,1.27; 4 0.46,1.27; 5 1.46,1.27; 6 2.46,1.27 | smd 1.2 x 1.8: P$1 -3.84,-0.955; P$2 3.76,-0.955
1X02 = drill 1.016 pad 1.88: 1 0,0; 2 2.54,0
MOLEX_1050170001 = smd 0.4 x 1.35: 1 -1.3,2.35; 2 -0.65,2.35; 3 0,2.35; 4 0.65,2.35; 5 1.3,2.35 | drill 0.85 pad 1.45: SH1 -2.5,2.35; SH2 2.5,2.35 | drill 0.6 pad 0.95 long: SH3 -3.5,-0.35; SH8 3.5,-0.35 | smd 0.438 x 1.9: SH4 -2.519,-0.35; SH7 2.519,-0.35 | smd 1.5 x 1.9: SH5 -1,-0.35; SH6 1,-0.35
1X04_1MM_RA = smd 0.6 x 1.35: 1 -1.5,0; 2 -0.5,0; 3 0.5,0; 4 1.5,0 | smd 1.2 x 2: NC1 2.8,-3.675; NC2 -2.8,-3.675
SCREWTERMINAL-3.5MM-4 = drill 1.2 pad 2.032 square: 1 0,0 | drill 1.2 pad 2.032: 2 3.5,0; 3 7,0; 4 10.5,0
SAMTECH_FTSH-105-01 = smd 0.508 x 1.27: 1 -2.54,-2.413; 2 -2.54,2.413; 3 -1.27,-2.413; 4 -1.27,2.413; 5 0,-2.413; 6 0,2.413; 7 1.27,-2.413; 8 1.27,2.413; 9 2.54,-2.413; 10 2.54,2.413
IND_FDSD0630-H-1R0M=P3 = smd 2 x 3.5: 1 -3,0; 2 3,0
JST-2-SMD = smd 1 x 4.6: 1 -1,-3.7; 2 1,-3.7 | smd 1.6 x 3.4: NC1 -3.4,1.5; NC2 3.4,1.5
SOT23 = smd 1 x 1.4: 1 -0.95,-1.1; 2 0.95,-1.1; 3 0,1.1
0603-RES = smd 1.1 x 1: 1 -0.85,0; 2 0.85,0
0603@1 = smd 1.1 x 1: 1 -0.85,0; 2 0.85,0
EXB38V = smd 0.6 x 0.8: 1 -1.275,-0.75; 4 1.275,-0.75; 5 1.275,0.75; 8 -1.275,0.75 | smd 0.5 x 0.8: 2 -0.4,-0.75; 3 0.4,-0.75; 6 0.4,0.75; 7 -0.4,0.75
TACTILE_SWITCH_SMD_5.2MM = smd 1.524 x 0.762: 1 -2.794,1.905; 2 2.794,1.905; 3 -2.794,-1.905; 4 2.794,-1.905
TACTILE_SWITCH_SMD_4.6X2.8MM = smd 0.9 x 1: 1 -2.05,-0.8; 2 2.05,-0.8; 3 2.05,0.8; 4 -2.05,0.8
SWITCH_SPST_SMD_A = smd 0.7 x 1.5: 1 -2.25,-1.75; 2 -0.75,-1.75; 3 2.25,-1.75 | smd 1 x 0.6: GND1 -3.65,1; GND3 3.65,1 | smd 1 x 0.8: GND2 -3.65,-1.1; GND4 3.65,-1.1 | hole 0.9: -1.5,0; 1.5,0
SWITCH_SPDT_PTH_11.6X4.0MM = drill 1.016 pad 1.88: 1 0,2.54; 2 0,0; 3 0,-2.54
B1,27 = smd 1.27 x 1.27: TP 0,0
SOT23-5 = smd 0.55 x 1.2: 1 -0.95,-1.3; 2 0,-1.3; 3 0.95,-1.3; 4 0.95,1.3; 5 -0.95,1.3
BC840M = smd 0.305 x 0.305: A0 0.66,5.966; A1 0.66,5.153; A2 0.66,4.366; A3 0.66,3.553; A4 0.66,2.765; A5 0.66,1.953; A6 0.66,1.165; A7 0.66,0.352; B0 1.448,5.966; B1 1.448,5.153; B2 1.448,4.366; B3 1.448,3.553; B4 1.448,2.765; B5 1.448,1.953; B6 1.448,1.165; B7 1.448,0.352; C0 2.261,5.966; C1 2.261,5.153; C2 2.261,4.366; C3 2.261,3.553; C4 2.261,2.765; C5 2.261,1.953; C6 2.261,1.165; C7 2.261,0.352; D0 3.048,5.966; D1 3.048,5.153; D2 3.048,4.366; D3 3.048,3.553; D4 3.048,2.765; D5 3.048,1.953; D6 3.048,1.165; D7 3.048,0.352; E0 3.861,5.966; E1 3.861,5.153; E2 3.861,4.366; E3 3.861,3.553; E4 3.861,2.765; E5 3.861,1.953; E6 3.861,1.165; E7 3.861,0.352; F0 4.648,5.966; F1 4.648,5.153; F2 4.648,4.366; F3 4.648,3.553; F4 4.648,2.765; F5 4.648,1.953; F6 4.648,1.165; F7 4.648,0.352; G0 5.461,5.966; G1 5.461,5.153; G2 5.461,4.366; G3 5.461,3.553; G4 5.461,2.765; G5 5.461,1.953; G6 5.461,1.165; G7 5.461,0.352; H0 6.248,5.966; H1 6.248,5.153; H2 6.248,4.366; H3 6.248,3.553; H4 6.248,2.765; H5 6.248,1.953; H6 6.248,1.165; H7 6.248,0.352
VSSOP-8 = smd 1.27 x 0.279: 1_1!OE -1.673,0.862; 2_1A -1.673,0.254; 3_2Y -1.673,-0.354; 4_GND -1.673,-0.962; 5_2A 1.773,-0.962; 6_1Y 1.773,-0.354; 7_2!OE 1.773,0.254; 8_VCC 1.773,0.862
CONV_TPS61235PRWLR = smd 1.24 x 0.44: 1 -0.9,0.77 | smd 3.04 x 0.44: 2 0,0.17 | smd 0.6 x 0.25: 3 -1.15,-0.475; 8 1.15,-0.475 | smd 0.25 x 0.6: 4 -0.75,-1.15; 5 -0.25,-1.15; 6 0.25,-1.15; 7 0.75,-1.15 | smd 1.59 x 0.44: 9 0.725,0.77
FC-12M = smd 0.7 x 1.4: 1 -0.85,0; 2 0.85,0

### Placement (x,y rotation side)
C1  1.75,17.09 270 top
C3  9.87,16.13 90 top
C6  31.27,30.74 270 top
C9  29.05,10.86 180 top
C10  11.53,44.07 270 top
C11  16.99,16.13 90 top
C12  5.08,44.11 90 top
C13  14.57,16.13 90 top
C15  12.22,16.13 90 top
C16  3.75,17.09 270 top
C17  28.99,16.61 180 top
C18  30.29,25.59 90 top
C19  33.21,10.01 180 top
C20  24.45,30.71 270 top
D1  23.24,17.02 0 top
D2  BLUE  [LED-0603']  8.41,51.06 180 top
D3  25.24,17.09 0 top
D7  16.67,22.8 90 top
D8  12.54,22.8 90 top
D9  RED  [LED-0603']  15.72,29.15 90 top
D10  21.84,26.01 180 top
J1  7.14,3.75 0 top
J2  20.8,23.12 90 bottom
J3  35.08,7.88 0 top
J4  15.72,50.84 180 top
J5  32.23,24.07 270 bottom
J6  29.37,3.75 180 top
J7  36.54,31.88 90 top
L4  5.56,22.8 180 top
POWER_IN  3.81,31.66 90 top
Q2  21.11,31.06 0 top
R4  23.18,13.59 90 top
R5  10.22,48.01 270 top
R6  25.24,13.59 90 top
R11  17.3,44.07 270 top
R14  13.18,29.15 270 top
R15  15.18,44.07 270 top
R17  2.7,14.23 0 top
RN1  26.51,25.66 90 top
RPROG  7.65,48.04 180 top
S1  35.72,3.75 180 top
S2  34.86,25.98 180 top
S3  27.5,50.9 0 top
S4  26.83,45.98 90 top
TP1  36.35,10.1 0 top
TP2  18.57,18.36 90 top
TP3  26.83,43.44 0 top
TP4  7.46,12.01 0 top
TP5  18.8,11.91 0 top
TP6  18.89,9.47 0 top
TP7  7.46,9.47 0 top
TP8  39.21,6.93 0 top
U2  8.29,44.33 270 top
U3  32.54,18.99 270 top
U4  27.78,30.74 270 top
U5  13.18,11.05 0 top
U8  7.08,16.45 270 top
Y2  29.69,13.91 90 top

### Tracks (layer width: path | path; a pad name or v marks a point on that pad's centre or on a via)
3.3V  (via drill 0.35)
  Top 0.152: U3.A7 31.74,18.33 31.4,18.67 27.24,18.67 v27.15,18.77 26.92,18.55 24.48,18.55 23.97,18.04 23.97,14.44 | v31.53,15.83 31.85,15.51 34.65,15.51 34.88,15.29 34.88,14.97 34.5,14.59 U3.F5 | v31.5,10.93 33.14,10.93 C19.1 34.16,10.1 TP1.TP | 25.24,14.33 R6.2 23.97,14.44 | 23.97,14.44 23.97,12.96 23.76,12.74 R4.1
  Top 0.2: 31.22,31.69 C6.1 | v38.89,28.2 38.89,29.28 J7.1
  Top 0.813: U4.5 31.22,31.69 | v30,33.6 29.08,32.67 | J7.1 38.07,29.34 36.67,30.74 36.67,35.18 v36.04,35.82
  Top 0.914: 29.08,32.67 U4.5
  Bottom 0.152: J2.2 26.67,21.58 27.85,22.76 27.85,23.94 32.64,28.73
  Bottom 0.2: v27.15,18.77 28.1,18.77 28.51,19.18 31.91,19.18 | 31.91,19.18 39.12,19.18 39.12,24.57 39.12,24.96 39.12,27.98 v38.89,28.2 | 31.91,19.18 31.91,16.21 v31.53,15.83 31.85,15.51 31.85,12.89
  Bottom 0.203: 31.85,12.89 31.85,11.28 v31.5,10.93 | 32.64,28.73 38.36,28.73 v38.89,28.2 | 33.63,24.57 J5.2 39.12,24.57
  Bottom 0.813: v30,33.6 32.23,35.82 v36.04,35.82
5V
  Top 0.152: 16.62,14.86 C11.1 | 18.29,15.23 18.29,15.17 18.57,15.18 19.84,15.24 | 8.13,15.41 7.93,15.47 U8.9
  Top 0.203: 8.41,15.73 8.4,15.73 | 8.1,15.73 U8.9
  Top 0.254: U8.6 5.31,16.2 4.29,15.18 3.06,15.18 2.7,14.82 2.7,13.63 3.37,12.96 6.83,12.96 7.85,13.98 U8.9
  Top 0.406: U5.8_VCC 16.23,11.92 18.57,14.26 18.57,15.18
  Top 0.508: 16.61,15.18 16.67,15.23
  Top 0.61: D8.C 15.72,24.95 D9.A
  Top 0.813: C3.1 9.57,15.23 | C13.1 16.67,15.23 C11.1 18.29,15.23 19.47,15.23 21.68,13.02 21.68,7.81 20.8,6.93 16.67,6.93 14.32,4.58 J1.3 | D7.C 16.67,24.63 18.26,23.05 18.26,19.31 18.57,18.99 TP2.TP 19.84,17.09 19.84,15.24
  Top 0.914: C3.1 8.89,15.23 8.71,15.41 8.4,15.73
  Top 1.016: C3.1 C15.1 C13.1 | D7.C D8.C | 8.71,15.41 8.13,15.41
  Bottom 0.61: J1.3 14.45,3.75 16.35,1.85 27.46,1.85 J6.1
D+  (via drill 0.35)
  Top 0.152: U3.A4 35.31,19.08 32.46,21.93 30.88,21.93
  Top 0.203: R15.2 15.18,42.26 v15.72,41.72 | 30.88,21.93 29.41,23.39 29.41,27.99 27.82,29.58 27.82,32.53 26.41,33.95 v25.53,33.95
  Bottom 0.152: v25.53,33.95 25.53,35.72 20.8,40.45 16.99,40.45 v15.72,41.72
D-  (via drill 0.35)
  Top 0.152: U3.A5 34.45,18.38 34.45,18.99 33.84,19.6
  Top 0.203: R11.2 17.3,41.12 v17.27,41.09 | 33.84,19.6 33.81,19.63 32.54,19.63 29.01,23.16 29.01,27.72 28.95,27.79 | 28.95,27.82 28.95,27.79 | 28.95,27.79 27.46,29.27 27.46,32.33 26.64,33.15 v26.42,33.15
  Bottom 0.152: v26.42,33.15 26.42,35.75 21.08,41.09 v17.27,41.09
GND  (via drill 0.35, 6.99)
  Top 0.152: J7.3 J7.5 38.96,32.64 J7.7 38.96,34.23 J7.9 38.96,34.75 37.25,36.45 34.32,36.45 32.3,34.44 32.3,30.01 32.13,29.84 C6.2 | U8.8 6.6,14.98 | S2.1 36.35,26.78 v35.05,28.07 | S2.2 31.74,26.78 v31.59,26.93 | U3.G0 38.13,13.91 37.54,13.91 37.31,13.68 37.31,11.05 35.31,11.05 | 11.01,8.49 12.54,6.96 12.54,2.8 11.59,1.85 6.97,1.85 J1.1 | 35.31,11.91 35.31,11.98 35.31,11.99 U3.H4 U3.G4 U3.G5 | 32.9,11.65 32.9,11.34 | v25.88,9.15 25.88,9.38 27.36,10.86 C9.2 28.15,10.07 28.44,9.78 30.19,9.78 30.42,10.01 | 32.9,11.34 32.86,11.34 | 32.86,11.34 31.84,11.34 31.72,11.46 31.28,11.46 30.58,10.76 30.58,10.17 30.42,10.01 | U3.G5 U3.G6 U3.H6 | U3.G5 U3.H5 | U3.H6 U3.H5 | U3.H6 U3.H7 32.9,11.37 32.86,11.34 | U3.H5 34.5,12.09 35.19,11.39 | U3.H6 33.71,11.69 33.36,11.34 32.9,11.34 | v21.75,17.72 21.75,18.99 v23.34,20.58 | J3.1 34.49,7.88 C19.2 30.42,10.01
  Top 0.2: 28.15,12.04 C9.2 | C3.2 C15.2 C13.2 | C20.2 25.38,30.74 U4.2
  Top 0.203: v35.05,23.63 35.01,23.59 32.87,23.59 31.91,24.55 31.91,26.78 | 5.76,17.2 U8.4 | U8.5 5.9,16.67 | v28.38,23.66 27.66,24.38 RN1.1 26.52,24.38 26.51,24.39 26.51,27.25 v25.88,27.88 25.88,28.38 C20.2 | U8.8 6.6,14.01 6.19,13.59 v5.56,13.59 | v2.06,12.01 1.85,12.22 R17.1 | v23.34,20.58 23.34,21.85 v24.92,23.44 | U5.4_GND 10.93,10.09 10.41,10.2 10,9.78 10,8.83 10.34,8.49 11.01,8.49 | U5.1_1!OE 11.7,12.44 11.91,12.64 12.86,12.64 13.18,12.32 13.18,11.37 13.24,11.31 | U5.7_2!OE 13.24,11.31 | 13.24,11.31 13.14,11.21 13.14,6.93 12.58,6.93 12.54,6.96
  Top 0.254: 38.96,34.55 38.96,34.23 | U8.4 U8.5 | v12.86,18.99 12.54,19.31 D8.A | v21.75,17.72 21.86,17.84 | 10.13,52.01 11.46,50.68 11.46,50.4 12.25,49.61 12.85,49.61 | D7.A 16.67,21.53 17.3,22.17 v17.4,22.17 | v19.53,21.85 22.07,21.85 v23.34,20.58 | 35.31,11.05 35.31,11.28 35.19,11.39 35.19,11.87 35.31,11.98 35.31,12.01
  Top 0.305: C13.2 14.64,16.96 | C17.2 27.77,16.29 27.77,15.49 27.78,15.48 v27.78,15.18 | v27.78,13.59 27.78,12.41 28.15,12.04 | U8.5 3.63,16.7 3.75,16.58 C16.2 | J4.5 14.25,48.66 14.25,48.91 13.54,49.61 12.85,49.61 | 10.13,52.01 8.41,52.01 8.34,51.94 8.34,50.52 6.8,48.98 6.8,47.57 | 14.64,16.96 16.92,16.96 C11.2 16.99,21.29 | 14.64,16.96 14.01,16.96
  Top 0.406: U8.1 8.29,17.35 | 38.96,34.23 38.96,32.64 J7.3 38.07,30.61 | C16.2 C1.2 1.85,16.08 R17.1
  Top 0.508: S1.1 32.36,8 C19.2
  Top 0.61: C6.2 31.27,28.31 S2.2 31.91,26.78 30.62,26.78 C18.2 | C12.2 5.71,44.96 6.34,44.33 U2.2 7.05,44.39 8.1,44.39 | 8.1,44.39 8.1,45.8 6.8,47.09 6.8,47.57 RPROG.2 | 8.1,44.39 8.1,43.12 8.73,42.49 10.79,42.49 C10.2 11.91,42.84 11.91,32.31 10.34,30.75 7.6,30.75 POWER_IN.1 10.82,30.66 R14.2 12.33,28.3 10.95,26.93 10.95,23.12 12.54,21.53 D8.A | v36.04,48.2 38.96,45.28 38.96,34.55
  Top 0.813: 8.03,17.35 8.29,17.35 8.6,17.03 C3.2 11.46,17.03 11.46,20.65 D8.A D7.A 16.67,20.97 | 16.67,20.97 16.67,21.6 16.35,21.29 16.35,20.65 14.03,18.33 | 16.99,21.29 16.67,20.97 | 14.01,16.96 14.13,17.09
  Top 1.27: C13.2 14.03,17.57 14.03,18.33
  Top 1.778: C3.2 C13.2
  Bottom 0.152: v35.05,28.07 32.73,28.07 v31.59,26.93 31.59,26.21 J5.1 | J2.1 v23.34,20.58
  Bottom 0.203: v31.59,26.93 31.59,26.86 v28.38,23.66 | v5.56,13.59 3.97,12.01 v2.06,12.01 | v24.92,23.44 24.92,26.93 v25.88,27.88
  Bottom 0.254: v5.56,13.59 7.46,13.59 v12.86,18.99 | v27.78,15.18 24.29,15.18 v21.75,17.72 | v17.4,22.17 19.21,22.17 v19.53,21.85
  Bottom 0.305: v27.78,15.18 v27.78,13.59 27.78,11.05 v25.88,9.15
  Bottom 0.61: J6.3 J6.4 16.67,3.75 14.76,5.66 7.78,5.66 6.97,4.84 J1.1 6.97,7.1 v2.06,12.01
  other vias: 29.11,20.36
  pour Top (isolate 0.005): -0.16,53.28 39.56,53.28 39.56,19.28 32.19,19.28 32.19,11.59 39.78,11.59 39.78,-0.38 -0.16,-0.38
  pour Bottom (isolate 0.005): -0.48,53.28 39.53,53.28 39.53,19.31 32.29,19.31 32.29,11.56 39.78,11.56 39.78,-0.06 -0.48,-0.06
HEADLAMP_3V3  (via drill 0.35)
  Top 0.152: U3.D7 32.42,15.94 30.32,18.04 27.65,18.04 26.62,17 26.62,11.48 23.97,8.83 v23.34,8.83
  Top 0.203: 7.64,12.18 TP4.TP | v19.88,8.47 19.81,8.41 17.58,8.41 15.9,10.09 U5.5_2A | 7.46,11.69 TP4.TP | TP4.TP 9.05,13.59 v15.4,13.59
  Bottom 0.152: 15.62,13.59 v15.4,13.59
  Bottom 0.203: 23.15,8.64 v23.34,8.83 22.98,8.47 v19.88,8.47 19.88,9.43 15.72,13.59 v15.4,13.59
HEADLAMP_5V
  Top 0.152: 7.78,9.47 TP7.TP
  Top 0.406: J1.2 10.64,5.01 9.05,6.61 9.05,9.47 | U5.3_2Y 9.77,10.7 9.05,9.97 9.05,9.47 | 7.78,9.47 9.05,9.47
LED_1  (via drill 0.35)
  Top 0.152: U3.D4 35.41,16.04 35.59,16.04 35.9,16.35 36.25,16.35 36.48,16.57 36.48,19.43 36.67,19.63 v36.67,19.74 | 27.53,19.37 v27.59,19.44 27.52,19.36 26.83,19.36 26.32,18.85 24.32,18.85 D1.C
  Bottom 0.152: v36.67,19.74 36.54,19.61 27.76,19.61 v27.59,19.44 27.27,19.44
LED_2
  Top 0.152: U3.C4 35.03,16.73 34.65,17.11 34.34,17.11 34.09,16.86 34.09,16.57 33.87,16.35 32.44,16.35 30.45,18.34 27.53,18.34 27.02,17.84 D3.C
N$1
  Top 0.152: D1.A 23.18,16.21 R4.2
N$2
  Top 0.152: C9.1 29.69,11.13 Y2.1 30,13.38 | 31.91,14.34 U3.F7
  Top 0.254: 31.91,14.34 30.63,13.06 Y2.1
N$3
  Top 0.305: U8.2 7.27,16.48 7.27,18.34
  Top 0.406: L4.1 8.56,19.63 7.27,18.34
N$4
  Top 0.2: 26.19,31.69 U4.1
  Top 0.406: D10.C 23.7,25.95 | C20.1 24.53,31.69 26.19,31.69
  Top 0.61: 24.38,31.61 C20.1 23.71,31.61 Q2.2 22.06,27.59 D10.C 24.39,25.26 RN1.7
N$5  (via drill 0.35)
  Top 0.61: RN1.2 28.33,25.26 28.42,25.34 28.42,27.28 v26.67,29.02 26.67,29.6 U4.3
N$8
  Top 0.152: D3.A 25.97,16.34 26.29,16.02 26.29,12.85 26.18,12.74 R6.1
N$11
  Top 0.61: U2.5 9.59,45.59 8.5,46.68 RPROG.1
N$12
  Top 0.203: R11.1 17.3,45.88 16.37,46.81 J4.2
N$13
  Top 0.61: R14.1 13.2,30.03 D9.C
N$14
  Top 0.61: D2.C 6.83,51.06 5.4,49.63 5.4,46.87 U2.1
N$15
  Top 0.61: D2.A 10,50.35 10,49.08 R5.1
N$16
  Top 0.203: R15.1 15.18,45.76 15.72,46.3 J4.3
N$17
  Top 0.152: C17.1 29.69,16.41 Y2.2 29.71,14.72 33.05,14.72 33.43,14.34 U3.F6
PIN_01  (via drill 0.35)
  Top 0.152: U3.D1 37.63,15.94 37.32,16.26 37.32,18.99 37.86,19.53 37.86,19.81 v37.43,20.23 | v26.83,22.48 27.78,21.53 v29.69,21.53
  Bottom 0.152: J2.3 22.16,22.48 v26.83,22.48 | v29.69,21.53 29.78,21.53 30.99,20.32 37.34,20.32 v37.43,20.23
PIN_02  (via drill 0.35)
  Top 0.152: U3.E0 38.61,15.03 38.79,15.03 39.2,14.62 39.2,10.93 38.79,10.52 v38.89,10.42
  Bottom 0.152: v38.89,10.42 35.75,10.42 33.64,8.31 25.53,8.31 16.5,17.34 16.5,24.77 18.57,26.84 18.57,27.56 18.89,27.88 22.38,27.88 23.97,26.29 23.97,24.71 22.84,23.58 J2.4
PIN_03  (via drill 0.35)
  Top 0.152: v37.94,11.37 38.89,12.32 38.89,14.5 38.67,14.72 38.1,14.72 U3.E1
  Bottom 0.152: v37.94,11.37 37.31,10.74 35.63,10.74 33.51,8.62 25.66,8.62 16.81,17.47 16.81,24.32 18.37,25.88 20.97,25.88 21.38,26.29 23.02,26.29 23.34,25.98 23.34,25.02 23.02,24.71 22.19,24.71 J2.5
PIN_04  (via drill 0.35)
  Top 0.152: U3.F4 35.69,13.96 35.69,11.72 v35.78,11.63
  Bottom 0.152: v35.78,11.63 32.95,11.63 31.72,10.4 31.28,10.4 30.74,10.93 30.74,12.97 24.3,19.41 21.83,19.41 20.8,20.45 20.8,25.34 21.03,25.58 J2.6
RESET  (via drill 0.35)
  Top 0.152: J7.10 33.37,34.42 32.7,33.75 32.7,28.36 33.81,27.25 33.81,25.18 | S2.4 33.81,25.18 | 33.81,25.18 S2.3 | S2.4 36.16,25.18 | S2.4 37.47,25.18 37.94,24.71 37.94,22.19 37.63,21.88 v34.35,21.88 | U3.B4 34.88,17.98 34.88,19.03 32.9,21 v32.54,21
  Bottom 0.152: v32.54,21 32.59,20.96 33.53,20.96 34.35,21.79 v34.35,21.88
SCL  (via drill 0.35)
  Top 0.152: U3.D6 33.96,15.94 34.36,16.35 35.47,16.35 35.72,16.6 35.72,18.49 35.72,19.63 37.22,21.13 v37.72,21.13
  Bottom 0.152: J5.4 36.94,22.57 37.72,21.79 v37.72,21.13
SDA  (via drill 0.35)
  Top 0.152: v31.27,12.62 32.62,13.96 33.87,13.96 34.09,14.18 34.09,14.2 34.12,14.23 34.12,14.72 U3.E6
  Bottom 0.152: v31.27,12.62 31.27,13.89 26.3,18.87 26.3,20.7 29.85,24.25 31.18,24.25 31.86,23.57 J5.3
STRIP_3V3  (via drill 0.35)
  Top 0.152: U3.E7 31.48,15.13 30.96,15.65 30.96,16.93 30.16,17.72 27.88,17.72 26.95,16.8 26.95,11.25 23.97,8.27 v23.97,8.2 | TP5.TP 18.13,11.91 v16.9,10.68
  Top 0.203: U5.2_1A 12.67,11.31 12.67,9.08 v12.38,8.8
  Bottom 0.152: v23.97,8.2 23.65,7.88 15.4,7.88 14.48,8.8 v12.38,8.8 14.26,10.68 v16.9,10.68
STRIP_5V  (via drill 0.35)
  Top 0.152: TP6.TP 17.3,9.47 16.03,10.74 14.99,10.74 U5.6_1Y
  Top 0.406: U5.6_1Y 14.86,10.72 13.93,10.72 13.72,10.51 13.72,7.25 13.73,7.24 v13.81,7.24
  Bottom 0.406: v13.81,7.24 14.22,7.24 15.75,5.72 24.22,5.72 25.87,4.08 J6.2
SWDCLK
  Top 0.152: J7.4 35.21,30.61 38.68,27.14 38.68,18.7 38.89,18.49 38.89,16.57 38.67,16.35 38.08,16.35 U3.C1
SWDIO
  Top 0.152: J7.2 33.81,29.34 33.81,27.77 35.67,25.9 37.71,25.9 38.38,25.24 38.38,18.74 38.13,18.49 38.13,17.66 38.01,17.54 U3.B1
SWITCH_1
  Top 0.152: U3.D5 34.62,15.82 34.78,15.82 35.08,15.51 35.47,15.51 35.69,15.29 35.69,15 35.96,14.72 36.25,14.72 36.48,14.5 36.48,14.24 36.75,13.96 37.07,13.96 37.32,14.21 37.32,15.29 37.54,15.51 38.74,15.51 39.54,14.71 39.54,10.31 39.15,9.92 39.15,6.93 | 39.15,6.93 39.15,6.29 S1.3 | 39.15,6.93 TP8.TP 38.58,6.93 J3.2
SWO
  Top 0.152: 34.13,31.82 J7.6 34.46,31.88 39.21,27.13 39.21,16.32 38.83,15.94 U3.D0
VBAT  (via drill 0.6)
  Top 0.152: 5.93,15.76 U8.7
  Top 0.203: U8.3 6.6,16.09 6.21,15.7 U8.7
  Top 0.254: U8.3 6.6,18.04
  Top 0.305: R17.2 3.6,14.18 | 3.97,14.55 3.6,14.18 | 3.6,14.18 3.44,14.02 | U8.7 5.42,15.7 5.28,15.56 5.28,15.17 4.28,14.18 3.6,14.18
  Top 0.406: 6.6,18.04 3.8,18.04 C16.1 C1.1
  Top 0.61: v2.38,25.34 2.56,25.17 L4.2 | Q2.3 21.11,42.8 S4.1 25.25,46.94 S3.1
  Top 0.813: L4.2 2.56,18.04 3.69,18.04 C16.1
  Bottom 0.61: v2.38,25.34 10.64,25.34 12.54,27.25 12.54,41.53 16.99,45.98 21.43,45.98 22.07,45.98 S4.1
VBAT_RAW  (via drill 0.6)
  Top 0.61: U2.3 5.08,43.38 C12.1 7.51,40.83 POWER_IN.2 10.37,32.66 v10.41,32.61 | S3.2 26.75,46.06 S4.2 TP3.TP
  Top 0.813: 26.84,43.45 TP3.TP
  Bottom 0.61: v10.41,32.61 10.41,43.22 14,46.8 22.64,46.8 23.4,47.57 25.56,47.57 26.32,46.8 26.45,46.8 26.83,46.43 S4.2
VBUS  (via drill 0.35)
  Top 0.152: v30.32,23.72 30.29,23.75 C18.1 | U3.B5 34.5,17.86 34.41,17.95 33.55,17.95 33.33,18.17 33.33,19.07 33.1,19.3 32.41,19.3 30.77,20.93 27.51,20.93 v27.38,20.8 | 11.49,45.19 11.59,45.19 C10.1 | J4.1
  Top 0.508: D10.A 19.96,26.09 19.95,26.1
  Top 0.61: Q2.1 20.04,29.84 | R5.2 11.49,45.89 11.49,45.19 11.49,44.96 | U2.4 9.83,43.38 9.87,43.34 9.9,43.34 11.51,44.94 C10.1 12.64,44.92 13.18,44.39 13.18,42.21 15.12,40.26 | J4.1 17.02,47.21 18.57,45.66 18.57,41.22 17.62,40.26 15.12,40.26 | Q2.1 20.16,25.97 20.48,25.66 20.39,25.66 D10.A | 19.96,26.09 19.96,25.23 20.8,24.38 RN1.8 25.88,24.27 25.88,22.31 v27.38,20.8 | 15.07,40.26 15.12,40.26 | Q2.1 20.16,31.26 15.24,36.18 15.24,40.14 15.12,40.26
  Top 0.813: 30.29,24.58 C18.1
  Bottom 0.254: v30.32,23.72 29.95,23.72 27.38,21.15 v27.38,20.8

### Text on the board
tPlace: Charging | - | + | [bike]swarm / swarms.city | - | + | NRF | GND | D | 5V | GND | B | D | 5V | LED Strip | -
bPlace: [bike]swarm / V9 6/24/2021 / swarms.city